# EAGLE schematic Power_5v_3_3_ap2112k (EAGLE 6.1)
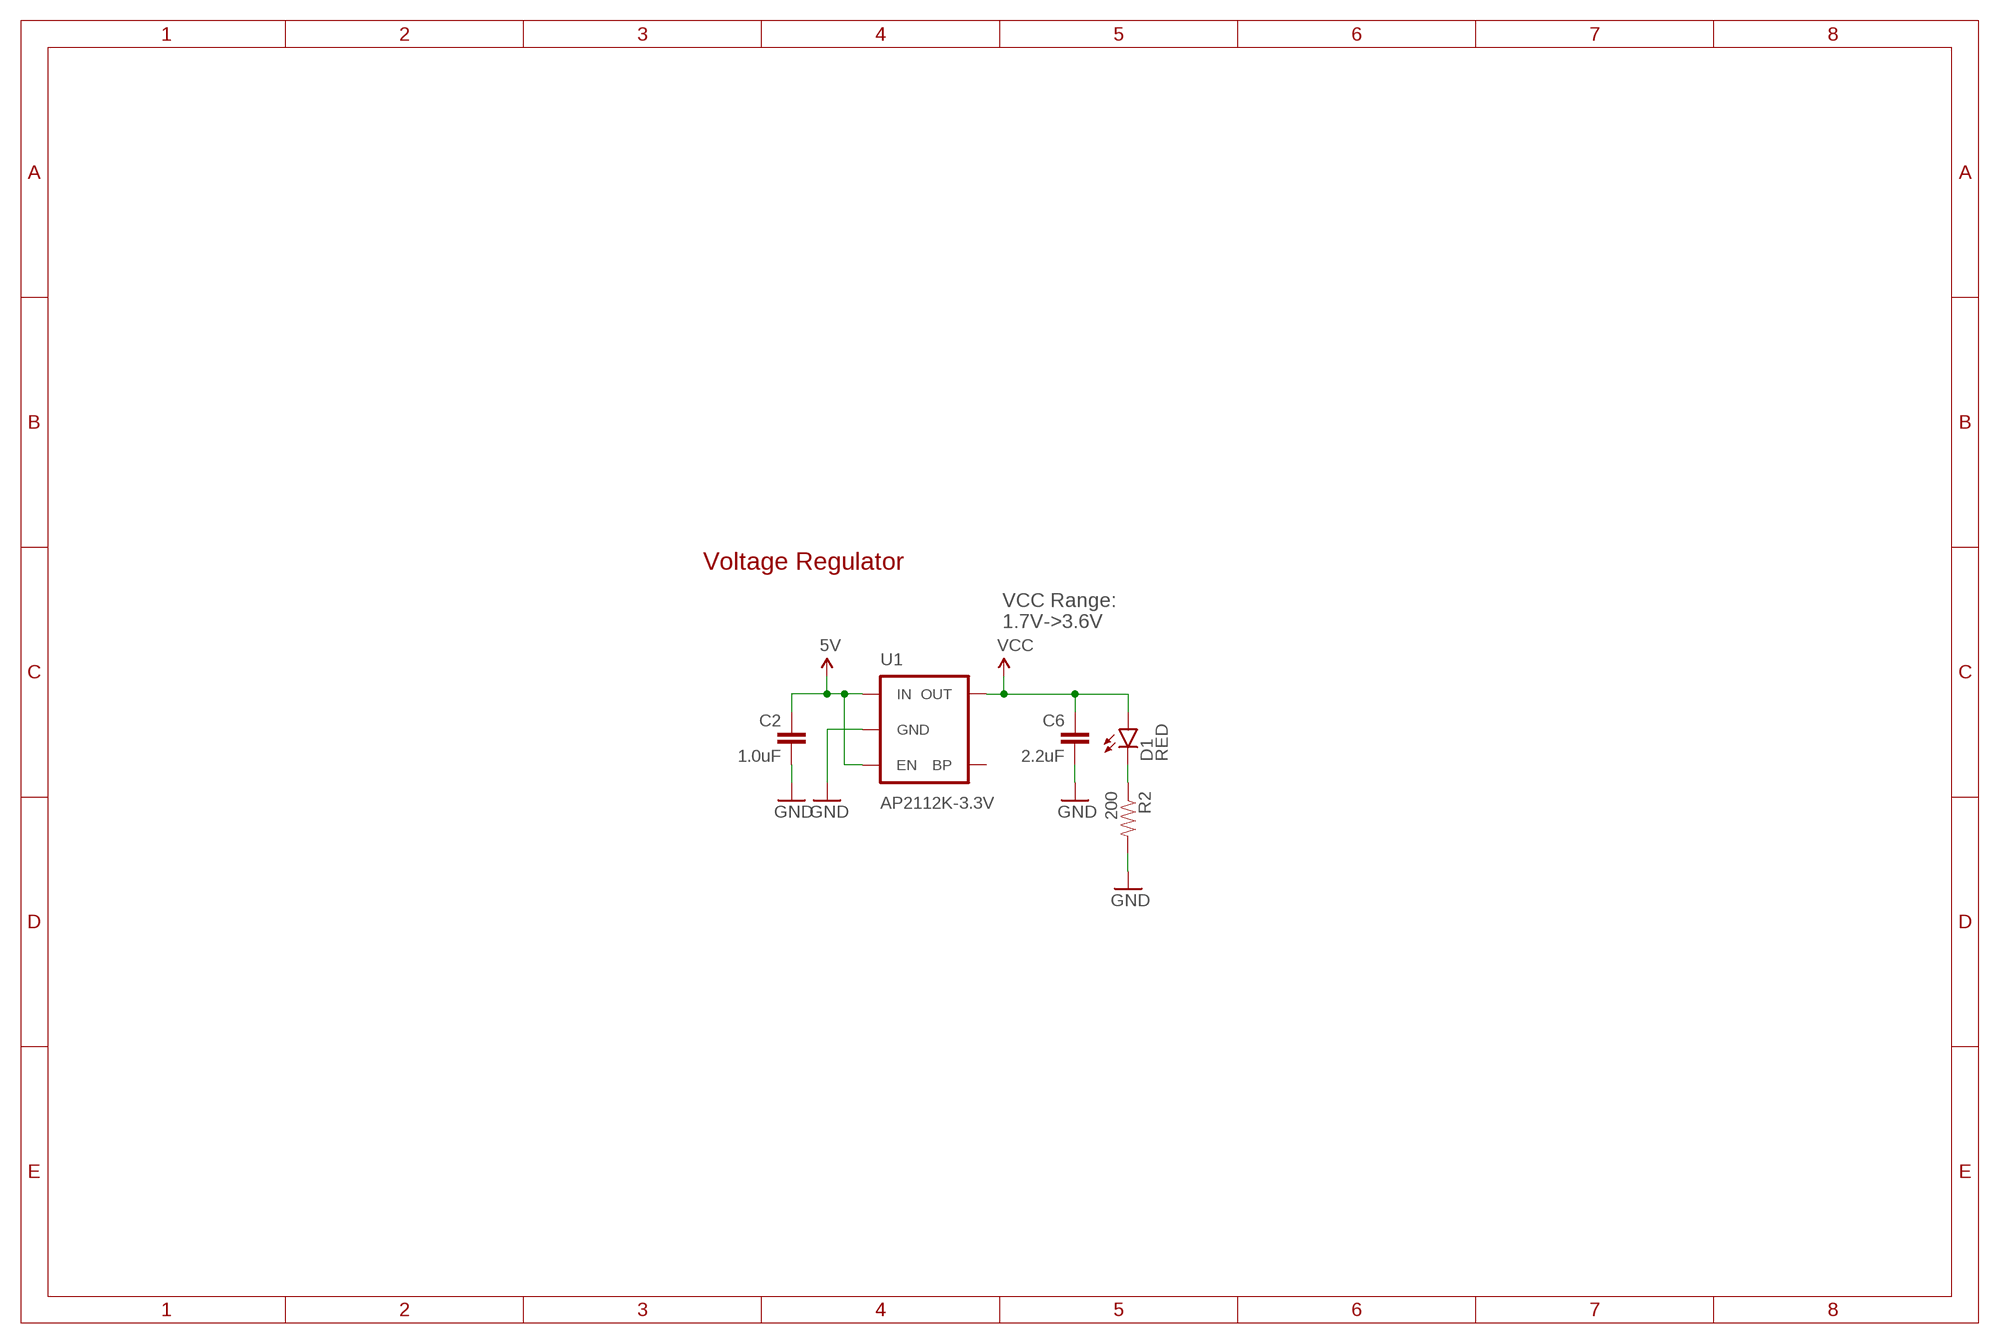
[diagram p0: schematic, sheet 1]

## Parts
C2  1.0uF  1.0UF-25V-+80/-20(0805)  [0805]
C6  2.2uF  2.2UF-10V-20%(0603)  [0603-CAP]
D1  RED  LED-RED0603  [LED-0603]
R2  200  200OHM1/10W1%(0603)  [0603-RES]
U1  AP2112K-3.3V  V_REG_LDOSMD  [SOT23-5]

## Nets
5V: C2.1 U1.1(IN) U1.3(EN)
GND: C2.2 C6.2 R2.2 U1.2(GND)
N$4: D1.C R2.1
VCC: C6.1 D1.A U1.5(OUT)
Unconnected: U1.4(BP)

## Notes on the sheet
- Voltage Regulator
- VCC Range:
  1.7V->3.6V

## Library data of the parts
C2 = SparkFun-Capacitors:1.0UF-25V-+80/-20(0805): CAP-11625; PROD_ID: CAP-11625
C6 = SparkFun-Capacitors:2.2UF-10V-20%(0603): CAP-07888; PROD_ID: CAP-07888
D1 = SparkFun-LED:LED-RED: Assorted Red LEDs LilyPad 1206- DIO-09912 1206- DIO-00809 0603- DIO-00819; PROD_ID: DIO-00819
R2 = SparkFun-Resistors:200OHM1/10W1%(0603): RES-08220; PROD_ID: RES-08220
U1 = SparkFun-PowerIC:V_REG_LDO: Voltage Regulator LDO Standard 150mA LDO voltage regulator in SOT-23 layout. Micrel part MIC5205. BP (by-pass) pin is used to lower output noise with 470pF cap.; PROD_ID: VREG-12457